# EAGLE board MO-v2-6 (EAGLE 8.3.2)
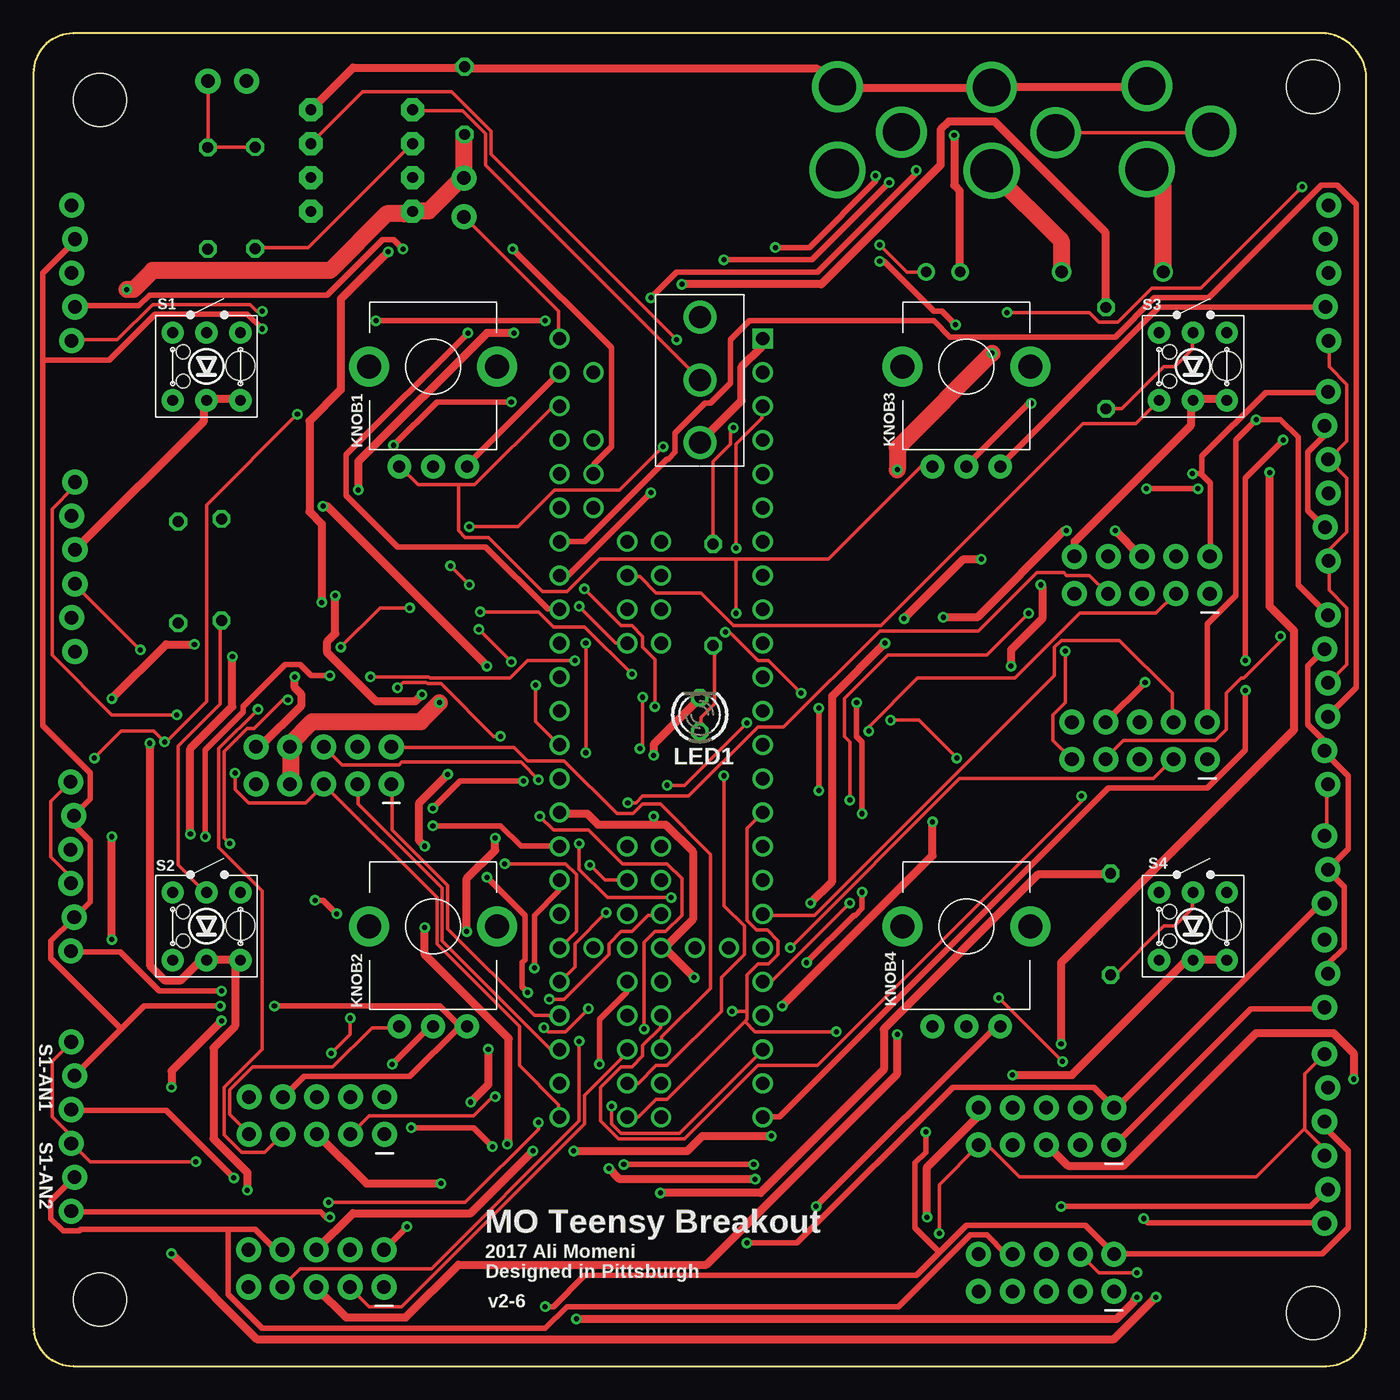
[diagram p1: board, top side]
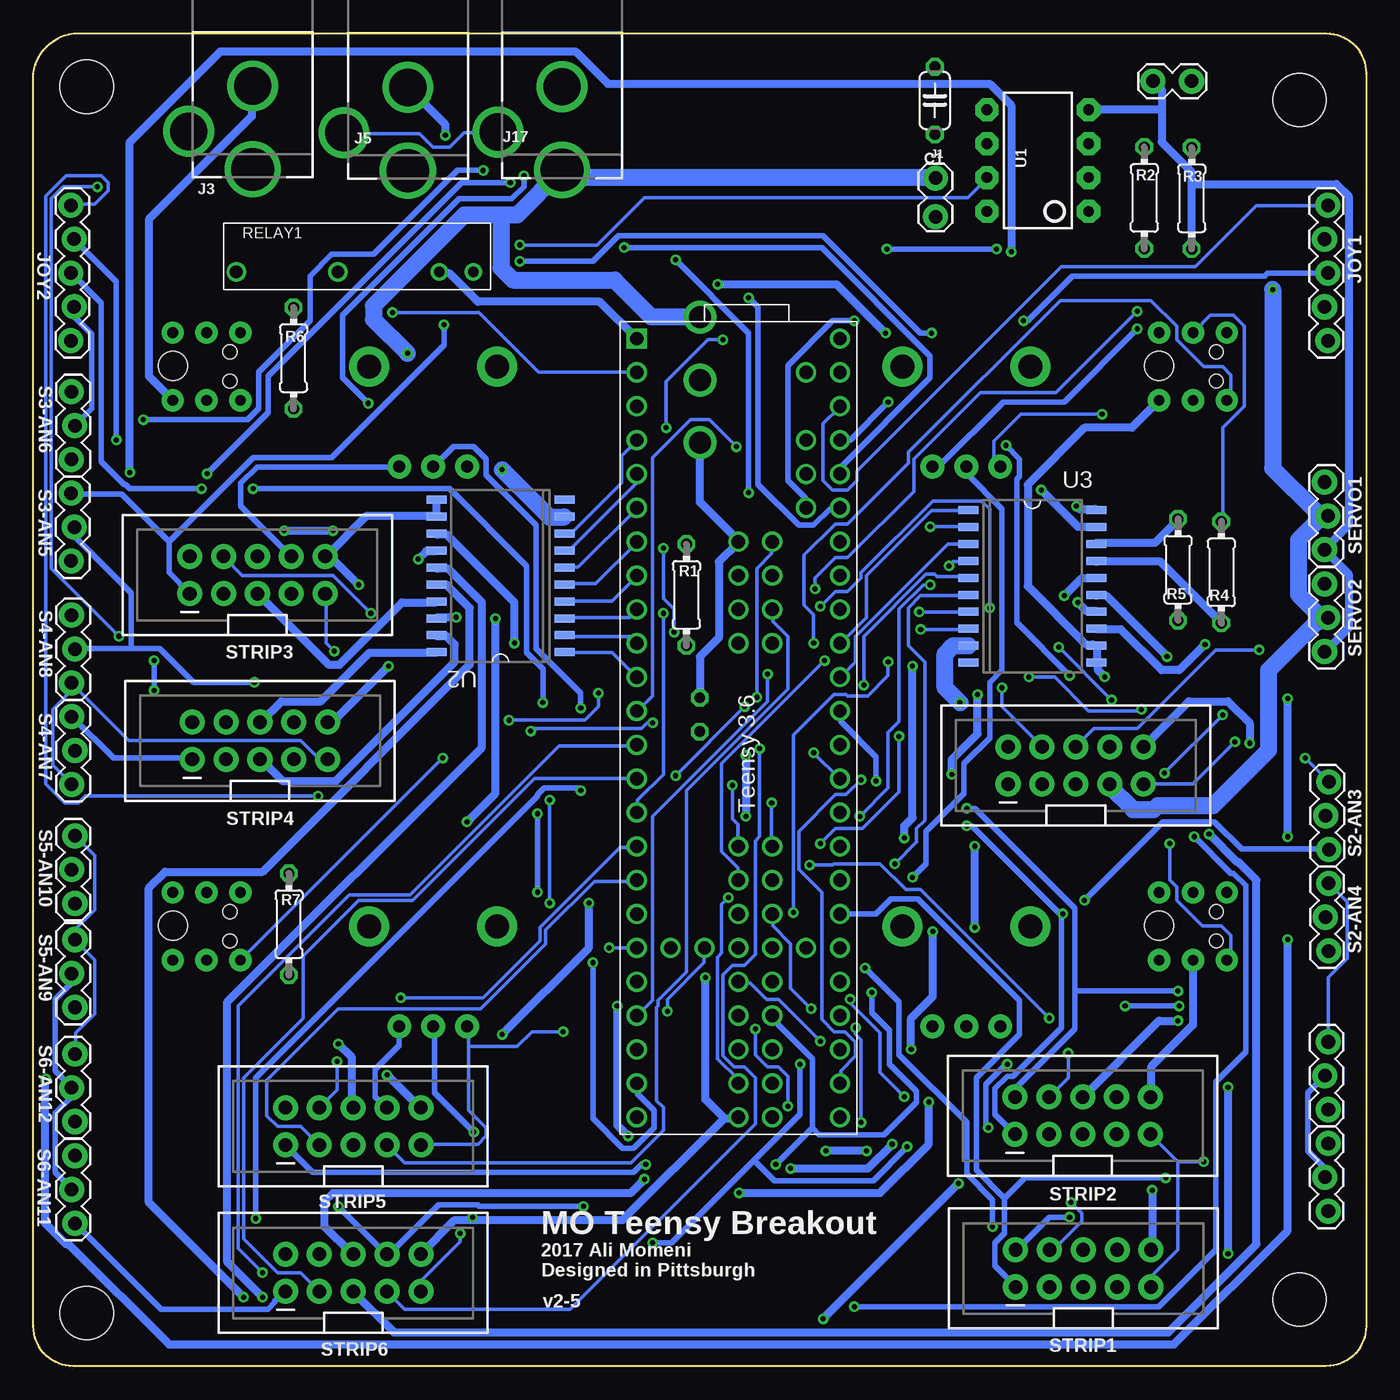
[diagram p2: board, bottom side, seen from below]

Size 100 x 100 mm. Coordinates in mm from the lower left corner, seen from the top.
Outline: 3,100 arc90 0,97 0,3 arc90 3,0 97,0 arc90 100,3 100,97 arc74 97,100 3,100
Copper layers (1*16): Top 0.035559375mm / dielectric 1.501140625mm / Bottom 0.035559375mm
Design rules "typical_4pcb *": minimum track width 10mil, minimum drill 15mil, track to track 6mil, track to pad 10mil, pad to pad 10mil, via to via 10mil, smd to smd 10mil, copper to edge 15mil, drill to drill 8mil, minimum pad ring 10mil, minimum via ring 8mil, stop-mask expansion 4mil, vias tented up to drill 0mil, thermal gap 10mil
Net classes: 0 default: width 0.254 mm, clearance 0.152 mm; 2 Power: width 0.61 mm, clearance 0.305 mm; 3 Analog Sig: width 0.406 mm, clearance 0.305 mm; 4 Power Source: width 1.27 mm, clearance 0.305 mm
Holes 4 mm at 5,5 96,4 96,96 5,95

## Footprints (pad centres in the part's own frame; a part is rotated, then mirrored left to right if it is on the bottom)
C050-024X044 = drill 0.813 octagon: 1 -2.54,0; 2 2.54,0
1X02_LOCK = drill 1.016 pad 1.88: 1 -0.178,0; 2 2.718,0
DCJACK_2MM_PTH = drill 2.8: GND 0,7.35; GNDBREAK 4.8,10.75 | drill 3.2: PWR 0,13.6
2X5-SHROUDED_LOCK = drill 1.016 pad 1.88: 1 -1.397,5.08; 2 1.397,5.08; 3 -1.397,2.54; 4 1.397,2.54; 5 -1.397,0; 6 1.397,0; 7 -1.397,-2.54; 8 1.397,-2.54; 9 -1.397,-5.08; 10 1.397,-5.08
1X05_LOCK = drill 1.016 pad 1.88: 1 0,0.127; 2 2.54,-0.127; 3 5.08,0.127; 4 7.62,-0.127; 5 10.16,0.127
POT_ALPHA_RD901F-40-(L)R1 = drill 0.9 pad 1.778: 1 -2.54,-7.5; 2 0,-7.5; 3 2.54,-7.5 | drill 1.8 pad 3: M1 -4.8,0; M2 4.8,0
LED3MM = drill 0.813 octagon: A -1.27,0; K 1.27,0
0204/7 = drill 0.813 octagon: 1 -3.81,0; 2 3.81,0
G6DN-1A = drill 0.8: 1 0,0; 2 2.54,0 | drill 0.95: 5 10.16,0; 8 17.78,0
SWITCH_TR2-MOMENTARY-LED = drill 0.8 pad 1.676: 1 2.54,-2.54; 2 2.54,2.54; 3 -2.54,-2.54; 4 -2.54,2.54; A 0,2.54; C 0,-2.54 | hole 2.2: 2.53,0.05 | hole 1.05: -1.76,1.1; -1.76,-1.09
1X03_LOCK = drill 1.016 pad 1.88: 1 0,0.127; 2 2.54,-0.127; 3 5.08,0.127
1X03_LOCK@1 = drill 1.016 pad 1.88: 1 0,0.127; 2 2.54,-0.127; 3 5.08,0.127
SWITCH_SPDT_500SSP1S2M2QEA = drill 1.65: 1 -4.7,0; 2 0,0; 3 4.7,0
TEENSY3-6_NO-USB-HOST = drill 1: 0 3.81,1.27; 1 6.35,1.27; 2 8.89,1.27; 3 11.43,1.27; 3V3(1) 36.83,1.27; 3V3(2) 46.99,6.35; 3V3(3) 6.35,16.51; 3V3(4) 59.69,11.43; 4 13.97,1.27; 5 16.51,1.27; 6 19.05,1.27; 7 21.59,1.27; 8 24.13,1.27; 9 26.67,1.27; 10 29.21,1.27; 11 31.75,1.27; 12 34.29,1.27; 13 34.29,16.51; 14 31.75,16.51; 15 29.21,16.51; 16 26.67,16.51; 17 24.13,16.51; 18 21.59,16.51; 19 19.05,16.51; 20 16.51,16.51; 21 13.97,16.51; 22 11.43,16.51; 23 8.89,16.51; 24 39.37,1.27; 25 41.91,1.27; 26 44.45,1.27; 27 46.99,1.27; 28 49.53,1.27; 29 52.07,1.27; 30 54.61,1.27; 31 57.15,1.27; 32 59.69,1.27; 33 59.69,16.51; 34 57.15,16.51; 35 54.61,16.51; 36 52.07,16.51; 37 49.53,16.51; 38 46.99,16.51; 39 44.45,16.51; 40 39.37,8.89; 41 41.91,8.89; 42 44.45,8.89; 43 49.53,8.89; 44 52.07,8.89; 45 54.61,8.89; 46 57.15,8.89; 47 57.15,11.43; 48 54.61,11.43; 49 52.07,11.43; 50 49.53,11.43; 51 44.45,11.43; 52 41.91,11.43; 53 39.37,11.43; 54 24.13,11.43; 55 21.59,11.43; 56 19.05,11.43; 57 16.51,11.43; A10 11.43,13.97; A11 13.97,13.97; AGND 3.81,16.51; AREF 8.89,13.97; DAC0 41.91,16.51; DAC1 39.37,16.51; DC 21.59,8.89; DD 24.13,8.89; DE 19.05,8.89; G1 46.99,8.89; G2 36.83,16.51; G3 59.69,8.89; G6 16.51,8.89; P 46.99,11.43; R 46.99,13.97; VBAT 46.99,3.81; VIN 1.27,16.51; VUSB 3.81,13.97 | drill 1 square: G0 1.27,1.27
DIP08 = drill 0.813 pad 1.727 octagon: 1 -3.81,-3.81; 2 -1.27,-3.81; 3 1.27,-3.81; 4 3.81,-3.81; 5 3.81,3.81; 6 1.27,3.81; 7 -1.27,3.81; 8 -3.81,3.81
SOIC20 = smd 0.6 x 1.5: 1 -5.715,-4.8; 2 -4.445,-4.8; 3 -3.175,-4.8; 4 -1.905,-4.8; 5 -0.635,-4.8; 6 0.635,-4.8; 7 1.905,-4.8; 8 3.175,-4.8; 9 4.445,-4.8; 10 5.715,-4.8; 11 5.715,4.8; 12 4.445,4.8; 13 3.175,4.8; 14 1.905,4.8; 15 0.635,4.8; 16 -0.635,4.8; 17 -1.905,4.8; 18 -3.175,4.8; 19 -4.445,4.8; 20 -5.715,4.8

## Placement (x,y rotation side)
C1  10uF  [C050-024X044]  32.36,94.95 90 bottom
J1  Teensy-5V  [1X02_LOCK]  32.31,86.42 90 bottom
J3  +5V OUT (to Pi)  [DCJACK_2MM_PTH]  83.54,103.4 180 bottom
J4  ACTUATORS  [2X5-SHROUDED_LOCK]  21.78,45.07 90 bottom
J5  +5V IN (Pi)  [DCJACK_2MM_PTH]  71.9,103.3 180 bottom
J12  RPi-Shutdown  [1X02_LOCK]  13.28,96.42 180 bottom
J17  +5V IN (Main)  [DCJACK_2MM_PTH]  60.33,103.35 180 bottom
JOY1  JOY1  [1X05_LOCK]  3,87.1 270 bottom
JOY2  JOY2  [1X05_LOCK]  97.06,76.94 90 bottom
KNOB1  [POT_ALPHA_RD901F-40-(L)R1]  30,75 0 top
KNOB2  [POT_ALPHA_RD901F-40-(L)R1]  30,33 0 top
KNOB3  [POT_ALPHA_RD901F-40-(L)R1]  70,75 0 top
KNOB4  [POT_ALPHA_RD901F-40-(L)R1]  70,33 0 top
LED1  [LED3MM]  50,48.88 90 top
R1  330  [0204/7]  51,57.87 270 bottom
R2  2.2K  [0204/7]  16.65,87.65 90 bottom
R3  3.3K  [0204/7]  13.09,87.63 270 bottom
R4  330  [0204/7]  10.87,59.56 90 bottom
R5  330  [0204/7]  14.12,59.76 270 bottom
R6  330  [0204/7]  80.48,75.63 270 bottom
R7  330  [0204/7]  80.82,33.16 270 bottom
RELAY1  RELAY-OMRON-G6DN  [G6DN-1A]  67,82.09 180 bottom
S1  SW-LEDPTH  [SWITCH_TR2-MOMENTARY-LED]  13,75 0 top
S1-AN1  AN5  [1X03_LOCK]  2.97,24.33 270 bottom
S1-AN2  AN6  [1X03_LOCK]  2.97,16.71 270 bottom
S2  SW-LEDPTH  [SWITCH_TR2-MOMENTARY-LED]  13,33 0 top
S2-AN3  AN7  [1X03_LOCK]  2.92,43.84 270 bottom
S2-AN4  AN8  [1X03_LOCK]  2.94,36.23 270 bottom
S3  SW-LEDPTH  [SWITCH_TR2-MOMENTARY-LED]  87,75 0 top
S3-AN5  AN5  [1X03_LOCK]  97.04,60.41 90 bottom
S3-AN6  AN6  [1X03_LOCK]  97.02,68.03 90 bottom
S4  SW-LEDPTH  [SWITCH_TR2-MOMENTARY-LED]  87,33 0 top
S4-AN7  AN7  [1X03_LOCK]  97,43.65 90 bottom
S4-AN8  AN8  [1X03_LOCK]  97.01,51.26 90 bottom
S5-AN9  AN5  [1X03_LOCK]  97,32 270 bottom
S5-AN10  AN6  [1X03_LOCK]  97,39.8 270 bottom
S6-AN11  AN7  [1X03_LOCK]  97,15.79 270 bottom
S6-AN12  AN8  [1X03_LOCK]  97,23.43 270 bottom
SERVO1  SERVO1  [1X03_LOCK@1]  3,61.25 90 bottom
SERVO2  SERVO2  [1X03_LOCK@1]  3,53.62 90 bottom
STRIP1  [2X5-SHROUDED_LOCK]  21.22,7.33 90 bottom
STRIP2  [2X5-SHROUDED_LOCK]  21.26,18.8 90 bottom
STRIP3  [2X5-SHROUDED_LOCK]  83.19,59.36 90 bottom
STRIP4  [2X5-SHROUDED_LOCK]  83,46.92 90 bottom
STRIP5  [2X5-SHROUDED_LOCK]  76,18 90 bottom
STRIP6  [2X5-SHROUDED_LOCK]  76,7 90 bottom
SW2  500SSP1S2M2QEA  [SWITCH_SPDT_500SSP1S2M2QEA]  50,74 270 top
TEENSY  TEENSY3_6-ALI_NO-USB-HOST  [TEENSY3-6_NO-USB-HOST]  55.99,78.37 270 bottom
U1  ATTINY85DIP08  [DIP08]  24.63,90.45 90 bottom
U2  A2982  [SOIC20]  64.95,59.29 90 bottom
U3  A2982  [SOIC20]  25.03,58.51 270 bottom

## Tracks (layer width: path | path; a pad name or v marks a point on that pad's centre or on a via)
+3V3  (via drill 0.38)
  Top 0.254: JOY2.1 97.23,76.91 97.23,74.98 98.55,73.66 98.55,69.39 97.23,68.07 S3-AN6.1 97.23,67.97 98.55,66.65 98.55,62.59 97.23,61.27 97.23,60.45 S3-AN5.1 97.23,60.35 97.23,58.22 98.55,56.9 98.55,52.63 97.23,51.31 S4-AN8.1 | v77.42,53.65 77.42,49.78 76.5,48.87 76.5,46.94 77.83,45.62 STRIP4.9 | 53.39,25.86 53.54,26.01 53.54,26.62 | 53.39,25.86 47.55,20.02 46.74,20.02 45.41,18.69 44.6,18.69 TEENSY.3V3(4) | 53.54,26.62 53.54,29.36 54.36,30.18 55.17,30.18 55.88,30.89 55.88,31.9 55.07,32.72 54.25,32.72 53.54,33.43 53.54,40.34 54.66,41.45 TEENSY.3V3(1) | 53.54,26.62 v52.43,26.62 | v67.97,9.96 67.97,13.61 70.92,16.56 STRIP5.9 71.02,16.56 71.63,16.56 73.97,14.22 91.75,14.22 95.3,17.78 95.4,17.78 | 95.4,17.78 96.83,16.36 96.83,15.85 S6-AN11.1 | 95.4,17.78 95.4,21.95 96.83,23.37 S6-AN12.1 | S4-AN7.1 97.03,43.59 97.03,39.93 96.93,39.83 S5-AN10.1 | 53.39,25.86 54.15,25.09 v60.25,25.09 | KNOB2.1 27.43,25.4 25.4,25.4 22.45,22.45 16.46,22.45 14.73,20.73 14.73,18.9 16.15,17.48 STRIP2.9 | S1-AN1.1 2.85,24.28 1.42,22.86 1.42,18.69 2.85,17.27 2.85,16.76 S1-AN2.1 2.95,16.66 4.27,15.34 v12.19,15.34 | S2-AN4.1 2.74,36.27 2.74,36.78 1.32,38.2 1.32,42.37 2.74,43.79 S2-AN3.1 | v4.57,45.62 6.6,47.65 9.04,47.65 v9.86,46.84 9.96,46.84 13.01,49.89 13.01,64.62 v19.81,71.42 | 31.9,66.14 28.85,66.14 27.53,67.46 KNOB1.1 | 31.9,66.14 33.12,66.14 38.91,71.93 39.42,71.93 TEENSY.3V3(3) | 52.73,60.55 42.47,60.55 40.03,58.12 38.2,58.12 34.14,62.18 32.41,62.18 31.9,62.69 31.9,66.14 | 52.73,60.55 59.64,60.55 66.55,67.46 67.36,67.46 KNOB3.1 | 52.73,60.55 v52.73,56.49
  Bottom 0.254: STRIP4.9 77.93,45.62 78.64,45.62 79.96,46.94 92.86,46.94 97.13,51.21 S4-AN8.1 96.93,50.9 98.55,49.28 98.55,45.11 97.13,43.69 S4-AN7.1 | v77.42,53.65 78.03,54.25 78.03,57.91 STRIP3.9 | v52.43,26.62 52.43,27.53 49.68,30.28 49.68,31.29 TEENSY.3V3(2) | 67.36,23.98 67.36,19.2 66.04,17.88 66.04,17.27 66.65,16.66 70.92,16.66 STRIP5.9 | 67.36,23.98 67.36,25.4 KNOB4.1 | v67.97,9.96 67.97,9.35 70.92,6.4 70.92,5.69 STRIP6.9 | S5-AN10.1 96.83,39.73 95.4,38.3 95.4,34.24 96.83,32.82 96.83,32 S5-AN9.1 96.83,31.9 95.4,30.48 95.4,26.42 96.83,24.99 96.83,23.47 S6-AN12.1 | v60.25,25.09 62.59,25.09 63.7,23.98 67.36,23.98 | 14.12,15.34 14.12,8.74 16.05,6.81 16.05,5.99 STRIP1.9 | 14.12,15.34 16.15,17.37 STRIP2.9 | v9.86,46.84 13.01,43.69 16.66,43.69 J4.9 | v4.57,45.62 2.85,43.89 S2-AN3.1 | S1-AN1.1 2.85,24.38 2.85,29.16 1.42,30.58 1.42,34.85 2.74,36.17 S2-AN4.1 | v12.19,15.34 14.12,15.34 | JOY1.1 2.95,87.07 8.23,87.07 12.8,82.5 22.86,82.5 38.2,67.16 38.2,66.45 38.91,65.73 40.03,65.73 40.74,66.45 40.74,70.71 39.52,71.93 TEENSY.3V3(3) | v19.81,71.42 25.91,71.42 27.94,69.39 27.94,67.97 27.53,67.56 KNOB1.1 | v52.73,56.49 52.73,44.4 54.66,42.47 54.66,41.55 TEENSY.3V3(1)
+5V  (via drill 0.38)
  Top 1.27: v30.48,49.78 29.06,48.36 20.93,48.36 19.3,46.74 19.3,46.53 J4.8 19.3,45.92 19.3,43.69 J4.7 | C1.1 32.31,92.35 32.31,89.2 J1.2 31.8,88.8 29.67,86.67 28.45,86.67 U1.8 27.84,86.46 26.52,86.46 22.25,82.19 8.94,82.19 7.52,80.77 v7.01,80.77 | v64.82,67.26 64.82,68.89 v71.93,76
  Bottom 1.27: v30.48,49.78 31.6,50.9 31.6,53.44 30.99,54.05 29.87,54.05 U3.9 | J4.7 19.3,43.59 17.48,41.76 15.95,41.76 15.65,42.06 11.48,42.06 7.32,46.23 7.32,52.22 3.76,55.78 SERVO2.2 2.95,56.19 3.35,56.19 5.08,57.91 5.08,61.98 3.35,63.7 2.95,63.7 SERVO1.2 3.76,64.11 7.01,67.36 v7.01,80.77 | v64.82,67.26 61.27,63.7 60.25,63.7 U2.9 | v71.93,76 74.47,78.54 74.47,79.55 67.67,86.36 64.92,86.36 | 64.92,86.36 63.7,86.36 60.35,89.71 J17.PWR 59.74,89.51 59.44,89.2 32.41,89.2 J1.2 | 64.92,86.36 64.92,82.4 64.01,81.48 56.39,81.48 53.65,78.74 50.09,78.74 SW2.1
+5V-BATTERY-PI
  Top 1.27: RELAY1.5 77.11,82.09 77.11,84.43 71.93,89.61 J5.PWR
AGND  (via drill 0.38)
  Top 0.406: S3-AN6.2 96.83,70.51 96.83,69.8 95.61,68.58 95.61,64.21 96.83,62.99 S3-AN5.2 | KNOB3.3 72.54,67.56 84.43,79.45 96.93,79.45 JOY2.2 | v83.41,51.31 80.47,48.36 STRIP4.8 | S4-AN8.2 96.83,53.75 95.61,52.53 95.61,48.16 96.83,46.94 96.83,46.23 S4-AN7.2 96.93,46.02 98.65,44.3 98.65,38.81 97.23,37.39 S5-AN10.2 97.13,37.19 98.35,35.97 98.35,31.39 97.13,30.18 S5-AN9.2 | v77.11,11.99 95.81,11.99 97.03,13.21 S6-AN11.2 | v58.73,11.99 72.14,25.4 72.44,25.4 KNOB4.3 | STRIP2.8 18.8,20.22 20.32,21.74 28.25,21.74 31.9,25.4 32.51,25.4 KNOB2.3 31.8,25.5 31.8,25.7 30.48,27.03 v18.09,27.03 | 14.63,10.26 3.56,10.26 3.45,10.16 2.23,10.16 1.32,11.07 1.32,12.39 3.05,14.12 S1-AN2.2 | 14.63,10.26 16.66,10.26 18.19,8.74 18.59,8.74 STRIP1.8 | v14.02,27.03 8.33,27.03 6.6,25.3 | 6.6,25.3 3.15,21.84 S1-AN1.2 | TEENSY.AGND 39.42,74.47 32.51,67.56 KNOB1.3 | 0.71,75.49 0.71,48.06 4.27,44.5 4.27,42.57 3.15,41.45 S2-AN3.2 3.05,41.25 3.05,40.64 4.27,39.42 4.27,34.85 3.15,33.73 S2-AN4.2 2.95,33.53 1.32,31.9 1.32,30.58 6.6,25.3 | 0.71,75.49 0.71,81.99 3.05,84.33 3.05,84.53 JOY1.2 | v17.17,77.83 16.05,78.94 9.14,78.94 5.69,75.49 0.71,75.49 | 14.63,10.26 14.63,5.38 17.17,2.85 38.41,2.85 40.03,4.47 64.92,4.47 70.31,9.86 71.53,9.86 72.95,8.43 73.46,8.43 STRIP6.8
  Bottom 0.406: KNOB3.3 72.54,67.46 83.21,67.46 84.43,66.24 84.43,64.52 80.67,60.76 STRIP3.8 | JOY2.2 96.93,79.45 96.93,78.74 95.61,77.42 95.61,71.83 96.83,70.61 S3-AN6.2 | v83.41,51.31 87.99,51.31 90.53,53.85 92.66,53.85 | 92.66,53.85 96.83,53.85 S4-AN8.2 | KNOB4.3 72.54,25.4 72.54,24.08 74.37,22.25 74.37,20.22 73.56,19.41 STRIP5.8 | v77.11,11.99 73.56,8.43 STRIP6.8 73.25,8.43 69.6,12.09 66.65,12.09 66.55,11.99 v58.73,11.99 | S6-AN11.2 97.13,13.31 98.35,14.53 98.35,19 97.13,20.22 97.13,20.83 S6-AN12.2 97.23,21.03 98.35,22.15 98.35,27.53 97.13,28.75 97.13,29.36 S5-AN9.2 | 92.66,53.85 92.66,58.01 96.83,62.18 96.83,62.89 S3-AN5.2 | S1-AN2.2 3.15,14.22 3.15,14.94 4.37,16.15 4.37,20.52 3.15,21.74 S1-AN1.2 | v14.02,27.03 v18.09,27.03 | v17.17,77.83 22.66,72.34 27.23,72.34 32,67.56 32.51,67.56 KNOB1.3
AN1  (via drill 0.38)
  Top 0.406: v15.04,14.12 9.96,19.2 2.95,19.2 S1-AN1.3
  Bottom 0.406: 27.13,12.6 29.26,14.73 29.26,21.64 26.01,24.89 26.01,27.43 33.63,35.05 35.66,35.05 36.78,33.93 39.42,33.93 TEENSY.39 | 27.13,12.6 27.13,9.96 27.84,9.25 27.84,7.52 26.31,5.99 STRIP1.1 | v15.04,14.12 25.6,14.12 27.13,12.6
AN2  (via drill 0.38)
  Top 0.406: v37.59,29.87 37.59,33.83 39.42,35.66 39.42,36.37 TEENSY.DAC0 | v28.04,10.46 26.31,8.74 STRIP1.2 | v22.25,11.18 21.95,11.18 21.54,11.58 2.95,11.58 S1-AN2.3
  Bottom 0.406: v37.59,29.87 35.05,27.33 35.05,23.37 29.97,18.29 29.97,14.43 28.04,12.5 v28.04,10.46 | v22.25,11.18 23.77,11.18 26.21,8.74 STRIP1.2
AN3  (via drill 0.38)
  Top 0.406: v29.97,40.54 35.05,40.54 36.58,39.01 39.42,39.01 TEENSY.DAC1 | v21.13,34.95 21.74,34.95 v22.76,33.93
  Bottom 0.406: v29.97,40.54 29.57,40.54 22.86,33.83 | 22.86,33.83 22.86,25.4 26.52,21.74 26.92,21.74 27.84,20.83 27.84,18.9 26.42,17.48 STRIP2.1 | v21.13,34.95 15.24,40.84 11.38,40.84 9.35,38.81 2.85,38.81 S2-AN3.3 | v22.76,33.93 22.86,33.83
AN4  (via drill 0.38)
  Top 0.406: v36.78,43.89 32,43.89 v29.97,41.86 | v14.12,28.14 9.45,28.14 6.5,31.09 2.85,31.09 S2-AN4.3
  Bottom 0.406: v36.78,43.89 36.78,45.72 39.42,48.36 39.42,49.07 TEENSY.15 | v29.97,41.86 29.36,41.86 21.84,34.34 21.84,28.14 | 21.84,28.14 21.84,25.3 26.31,20.83 26.31,20.22 STRIP2.2 | 21.84,28.14 v14.12,28.14
AN5  (via drill 0.38)
  Top 0.406: v32.61,77.52 23.47,68.38 23.47,65.33 27.33,61.47 33.93,61.47 38.61,56.79 39.42,56.79 TEENSY.18 | v63.5,82.91 63.8,82.91 67.56,79.15 68.17,79.15 v69.19,78.13
  Bottom 0.406: v32.61,77.52 33.43,77.52 40.74,84.84 56.08,84.84 58.01,82.91 v63.5,82.91 | v69.19,78.13 69.19,76.61 77.62,68.17 83.52,68.17 89.81,61.87 | 89.81,61.87 89.81,59.54 88.29,58.01 STRIP3.1 | 89.81,61.87 93.37,65.43 97.13,65.43 S3-AN5.3
AN6  (via drill 0.38)
  Top 0.406: v46.33,65.53 40.13,59.33 39.52,59.33 TEENSY.19 | v51.82,83.01 58.42,83.01 v64.21,88.8 | 87.58,66.95 v86.97,66.95 | 87.58,66.95 88.29,66.24 88.29,60.76 STRIP3.2 | S3-AN6.3 97.13,73.05 92.46,73.05 87.68,68.28 87.68,67.06 87.58,66.95
  Bottom 0.406: v46.33,65.53 46.33,77.52 v51.82,83.01 | v64.21,88.8 67.87,88.8 82.4,74.27 82.4,71.53 v86.97,66.95
AN7
  Top 0.406: TEENSY.20 39.52,61.87 41.35,61.87 47.55,68.07 47.65,68.07 48.16,68.58 48.16,70 50.39,72.24 50.8,72.24 52.32,73.76 52.32,77.01 53.75,78.44 67.56,78.44 68.78,77.22 81.18,77.22 84.12,80.16 88.19,80.16 96.62,88.59 97.84,88.59 99.26,87.17 99.26,50.9 97.13,48.77 S4-AN7.3
  Bottom 0.406: STRIP4.1 88.09,45.62 93.98,45.62 97.03,48.67 S4-AN7.3
AN8  (via drill 0.38)
  Top 0.406: v46.33,80.16 48.26,82.09 58.83,82.09 66.24,89.51 v66.24,89.71 | S4-AN8.3 97.13,56.39 94.89,58.62 94.89,69.7 93.57,71.02 v91.75,71.02 90.22,69.49 90.22,57.81 88.09,55.68 88.09,48.36 STRIP4.2
  Bottom 0.406: v46.33,80.16 45.62,79.45 45.62,66.14 42.57,63.09 41.45,63.09 40.23,64.31 39.52,64.31 TEENSY.21 | v66.24,89.71 68.17,89.71 74.47,83.41 77.62,83.41 79.25,81.79 79.25,78.44 83.11,74.57 83.11,71.83 83.92,71.02 v91.75,71.02
AN9  (via drill 0.38)
  Top 0.406: v54.05,15.14 v44.3,15.14 | v34.04,36.68 36.88,33.83 36.88,30.48 36.68,30.28 36.68,28.45 v37.08,28.04 | S5-AN9.3 96.83,26.82 91.34,26.82 81.18,16.66 STRIP5.1
  Bottom 0.406: 41.55,17.88 41.55,23.06 44.5,26.01 44.5,26.21 TEENSY.49 | v44.3,15.14 41.55,17.88 | v54.05,15.14 54.36,15.14 54.97,14.53 79.05,14.53 81.08,16.56 STRIP5.1 | v34.04,36.68 33.02,37.69 33.02,40.13 30.18,42.98 30.18,45.21 28.25,47.14 28.25,51.31 27.33,52.22 27.33,64.31 29.97,66.95 29.97,67.46 KNOB1.2 | v37.08,28.04 37.08,26.52 35.76,25.2 35.76,22.66 33.73,20.62 33.73,19.81 36.17,17.37 41.05,17.37 41.55,17.88
AN10  (via drill 0.38)
  Top 0.406: v42.47,22.66 42.47,26.01 44.5,28.04 44.5,28.75 TEENSY.50 | v53.54,9.25 57.3,9.25 68.99,20.93 79.55,20.93 STRIP5.2 81.28,19.41 96.52,34.65 96.83,34.65 S5-AN10.3 | v26.92,22.66 29.67,25.4 29.97,25.4 KNOB2.2 | v28.35,17.88 33.02,17.88 v34.44,16.46
  Bottom 0.406: v42.47,22.66 42.47,18.9 45.92,15.44 | 45.92,15.44 52.12,9.25 v53.54,9.25 | v26.92,22.66 27.13,22.45 27.23,22.45 28.55,21.13 28.55,18.09 v28.35,17.88 | v34.44,16.46 36.98,13.92 44.4,13.92 45.92,15.44
AN11  (via drill 0.38)
  Top 0.406: v55.68,83.92 58.22,83.92 63.2,88.9 v63.2,89.31 | v74.88,72.24 74.68,72.24 70,67.56 KNOB3.2 | v83.31,11.07 83.62,10.77 96.83,10.77 S6-AN11.3 | v58.93,49.38 v58.93,43.18
  Bottom 0.406: STRIP6.1 81.18,5.59 81.89,4.88 81.89,4.78 82.4,4.27 90.42,4.27 96.83,10.67 S6-AN11.3 | v55.68,83.92 40.84,83.92 32.72,75.79 32.72,74.17 39.42,67.46 39.42,66.95 TEENSY.22 | v63.2,89.31 63.2,88.49 64.11,87.58 68.07,87.58 76.81,78.84 76.81,74.17 v74.88,72.24 | v83.31,11.07 83.31,21.64 62.18,42.77 62.18,42.88 61.67,43.38 59.13,43.38 v58.93,43.18 | v58.93,49.38 58.93,50.49 62.28,53.85 62.28,63.09 66.04,66.85 66.04,68.07 66.95,68.99 68.48,68.99 69.9,67.56 KNOB3.2
AN12  (via drill 0.38)
  Top 0.406: v35.87,72.34 30.28,72.34 v27.03,69.09 | v22.25,51.82 20.83,51.82 20.02,52.63 18.9,52.63 15.75,49.48 15.75,49.07 12.9,46.23 v12.9,39.73 | v38.41,4.47 39.01,4.47 41.35,6.81 66.24,6.81 67.97,8.53 | 67.97,8.53 70,10.57 78.94,10.57 81.08,8.43 STRIP6.2 81.28,8.43 96.72,8.43 98.65,10.36 98.65,16.15 96.93,17.88 96.93,18.29 S6-AN12.3 | v66.95,17.58 66.95,16.05 66.14,15.24 66.14,10.36 67.97,8.53
  Bottom 0.406: v35.87,72.34 38.71,69.49 39.42,69.49 TEENSY.23 | v27.03,69.09 26.01,68.07 26.01,66.75 26.21,66.55 26.21,55.78 v22.25,51.82 | v12.9,39.73 10.16,36.98 9.96,36.98 9.04,36.07 9.04,23.57 11.28,21.34 11.28,8.74 15.54,4.47 v38.41,4.47 | v66.95,17.58 69.9,20.52 69.9,25.4 KNOB4.2
BTN1
  Top 0.254: TEENSY.48 44.5,23.67 44.5,23.47 41.35,20.32 41.35,18.19 27.64,4.47 25.2,4.47 23.77,5.89 STRIP1.3
BTN2  (via drill 0.38)
  Top 0.254: v41.66,26.82 39.93,25.09 38.61,25.09 v38.3,25.4 | v37.9,18.29 37.9,17.78 32.41,12.29 v22.15,12.29
  Bottom 0.254: v41.66,26.82 43.18,28.35 43.18,31.7 44.5,33.02 44.5,33.83 TEENSY.51 | v38.3,25.4 38.3,24.89 37.9,24.49 v37.9,18.29 | v22.15,12.29 21.34,11.48 21.34,10.87 23.47,8.74 23.67,8.74 STRIP1.4
BTN3  (via drill 0.38)
  Top 0.254: v38.71,27.53 39.83,27.53 43.18,30.89 43.18,31.7 44.09,32.61 44.91,32.61 46.13,33.83 47.04,33.83 TEENSY.42 | v34.65,20.22 34.44,20.22 33.02,18.8 25.2,18.8 23.88,17.48 STRIP2.3
  Bottom 0.254: v38.71,27.53 38.71,27.23 36.47,24.99 36.47,22.05 v34.65,20.22
BTN4  (via drill 0.38)
  Top 0.254: v41.76,37.59 42.88,36.47 44.5,36.47 TEENSY.52 | v23.77,26.11 23.77,24.89 v22.35,23.47
  Bottom 0.254: v41.76,37.59 40.03,37.59 39.93,37.69 36.47,37.69 34.54,35.76 33.43,35.76 v23.77,26.11 | v22.35,23.47 22.35,21.64 23.77,20.22 STRIP2.4
BTN5  (via drill 0.38)
  Top 0.254: v47.55,43.59 48.87,43.59 v53.54,48.26 | v62.69,47.65 62.69,47.95 66.34,51.61 73.66,51.61 78.54,56.49 84.23,56.49 85.65,57.91 STRIP3.3
  Bottom 0.254: v47.55,43.59 47.55,41.05 47.14,40.64 47.14,39.01 TEENSY.40 | v53.54,48.26 53.95,48.26 54.36,47.85 62.48,47.85 v62.69,47.65
BTN6  (via drill 0.38)
  Top 0.254: v61.27,34.75 55.37,28.85 54.76,28.85 TEENSY.28 | v61.27,42.47 61.27,46.84 60.86,47.24 60.86,50.09 64.11,53.34 71.53,53.34 v74.68,56.49
  Bottom 0.254: v61.27,42.47 v61.27,34.75 | v74.68,56.49 77.52,59.33 84.33,59.33 85.65,60.66 STRIP3.4
BTN7  (via drill 0.38)
  Top 0.254: v56.79,31.39 69.49,44.09 84.02,44.09 85.45,45.52 STRIP4.3
  Bottom 0.254: v56.79,31.39 54.76,31.39 TEENSY.27
BTN8
  Top 0.254: TEENSY.26 54.76,33.83 58.62,33.83 76.61,51.82 76.61,53.95 77.11,54.46 81.48,54.46 85.45,50.49 85.45,48.36 STRIP4.4
BTN9
  Bottom 0.254: TEENSY.25 54.76,36.37 57.91,36.37 61.57,32.72 61.57,31.7 66.45,26.82 77.11,26.82 82.5,21.44 82.5,18.8 81.69,17.98 79.96,17.98 78.64,16.66 STRIP5.3
BTN10  (via drill 0.38)
  Top 0.254: v77.22,22.86 v72.44,27.64
  Bottom 0.254: v72.44,27.64 66.24,27.64 61.98,31.9 61.98,32.92 55.98,38.91 54.76,38.91 TEENSY.24 | v77.22,22.86 77.22,20.73 STRIP5.4
BTN11
  Bottom 0.254: TEENSY.12 54.76,44.09 62.38,44.09 71.53,34.95 75.59,34.95 79.76,30.79 79.76,26.11 84.23,21.64 84.23,9.55 81.69,7.01 79.96,7.01 78.64,5.69 STRIP6.3
BTN12  (via drill 0.38)
  Top 0.254: v82.8,7.01 79.96,7.01 78.64,8.33 STRIP6.4
  Bottom 0.254: v82.8,7.01 84.63,8.84 84.63,27.03 76.3,35.36 71.73,35.36 60.55,46.53 54.76,46.53 TEENSY.11
BTN13  (via drill 0.38)
  Top 0.254: v41.45,54.25 v41.45,46.02
  Bottom 0.254: v41.45,46.02 39.52,44.09 TEENSY.13 | v41.45,54.25 41.45,56.39 42.16,57.1 42.16,60.86 39.83,63.2 38.91,63.2 34.34,67.77 34.34,68.58 22.96,79.96 16.15,79.96 14.22,78.03 14.22,77.01 12.19,74.98 10.77,74.98 10.16,74.37 10.16,72.75 10.36,72.54 S1.3
BTN14  (via drill 0.38)
  Top 0.254: v40.95,57 43.69,54.25 44.5,54.25 TEENSY.54 | v28.25,56.9 26.01,56.9 v23.06,53.95 | v19.1,49.99 18.69,49.99 16.56,47.85 16.05,47.85 14.33,46.13 14.33,39.62 v14.73,39.22
  Bottom 0.254: v40.95,57 39.83,58.12 38.91,58.12 37.9,59.13 37.9,59.54 32.51,64.92 28.85,64.92 28.25,64.31 v28.25,56.9 | v19.1,49.99 v23.06,53.95 | v14.73,39.22 14.73,36.47 14.22,35.97 14.22,34.95 12.29,33.02 10.87,33.02 10.16,32.31 10.16,30.68 10.36,30.48 S2.3
BTN15
  Top 0.254: TEENSY.56 44.6,59.23 45.52,59.23 46.74,58.01 50.09,58.01 52.53,55.58 63.6,55.58 78.74,70.71 82.7,70.71 84.43,72.44 S3.3
BTN16  (via drill 0.38)
  Top 0.254: v52.73,61.37 52.73,69.19 54.66,71.12 54.66,71.93 TEENSY.1 | v51.92,55.07 52.22,55.07 54.36,52.93 55.17,52.93 v57.61,50.49 | v64.31,48.46 66.45,48.46 v69.29,45.62
  Bottom 0.254: v52.73,61.37 52.73,57.61 51.92,56.79 v51.92,55.07 | v57.61,50.49 57.61,49.48 58.62,48.46 v64.31,48.46 | v69.29,45.62 84.43,30.48 S4.3
GND  (via drill 0.38)
  Top 0.61: v16.05,13.21 16.05,14.53 13.51,17.07 13.51,23.88 15.14,25.5 15.14,30.28 S2.1 15.44,30.48 13.01,30.48 S2.C 12.7,30.38 12.5,30.38 11.07,28.96 9.86,28.96 8.74,30.07 v8.74,46.74 | v19.61,51.71 19.61,50.9 20.12,50.39 20.12,49.58 17.07,46.53 16.76,46.53 J4.10 | S1.1 15.44,72.54 13.01,72.54 S1.C 12.8,72.24 12.8,70.92 3.15,61.27 SERVO1.1 | 46.53,40.64 42.37,40.64 41.55,41.45 39.52,41.45 TEENSY.G2 | 46.53,40.64 47.45,40.64 49.48,38.61 49.48,33.53 47.35,31.39 47.14,31.39 TEENSY.G1 47.55,31.19 v49.58,29.16 | S4.1 89.51,30.48 87.07,30.48 S4.C 86.77,30.28 86.36,30.28 77.93,21.84 v73.46,21.84 | v67.06,11.18 67.06,14.94 70.92,18.8 70.92,19.3 STRIP5.10 | TEENSY.G0 54.66,77.01 54.66,76.5 53.14,74.98 53.14,72.44 50.09,69.39 SW2.3 | S3.1 89.51,72.54 87.07,72.54 S3.C 86.87,72.24 86.87,70.61 78.13,61.87 78.13,60.76 STRIP3.10 | v73.36,52.53 73.36,53.75 75.69,56.08 75.69,58.52 v75.59,58.62 | U1.4 20.83,94.28 23.98,97.43 32.31,97.43 C1.2 32.61,97.33 58.83,97.33 60.05,96.11 J17.GND 60.35,95.91 71.83,95.91 J5.GND 72.14,96.01 83.52,96.01 J3.GND | v69.09,92.35 69.09,88.59 69.49,88.19 69.49,82.09 RELAY1.2 | v46.53,41.25 46.53,40.64 | v46.53,45.82 46.53,46.63 49.99,50.09 LED1.K
  Bottom 0.61: v16.05,13.21 16.05,8.74 STRIP1.10 | STRIP2.10 16.15,20.22 16.15,22.45 13.01,25.6 13.01,30.38 S2.C | v19.61,51.71 20.12,52.22 20.12,52.53 U3.11 20.22,52.83 20.22,54.05 U3.12 20.52,54.15 21.03,54.15 25.4,58.52 25.4,66.14 21.13,70.41 17.58,70.41 15.54,72.44 S1.1 | SERVO2.1 3.05,53.65 1.32,55.37 1.32,59.44 3.05,61.16 SERVO1.1 2.95,61.47 1.32,63.09 1.32,87.78 2.23,88.7 13.11,88.7 | v8.74,46.74 8.74,48.26 10.36,49.89 13.31,49.89 16.66,46.53 J4.10 | 48.16,18.59 47.14,18.59 TEENSY.G3 | 48.16,18.59 55.78,10.97 67.06,10.97 | 67.06,10.97 68.38,10.97 70.92,8.43 STRIP6.10 | v67.06,11.18 67.06,10.97 | v73.46,21.84 71.02,19.41 STRIP5.10 | v49.58,29.16 49.58,20.02 48.16,18.59 | RELAY1.2 69.49,81.99 68.78,81.99 66.65,79.86 57.51,79.86 54.76,77.11 TEENSY.G0 | LED1.K 49.99,50.19 49.99,53.24 48.56,54.66 48.56,60.35 47.14,61.77 TEENSY.G6 47.24,62.08 49.99,64.82 49.99,69.29 SW2.3 | U2.11 69.8,64.92 69.8,63.8 U2.12 70.1,63.8 74.98,63.8 78.03,60.76 STRIP3.10 77.72,60.76 v75.59,58.62 | v73.36,52.53 77.52,48.36 77.83,48.36 STRIP4.10 | 13.11,88.7 13.11,89.61 15.34,91.85 15.34,94.28 | 13.11,88.7 13.11,83.82 R3.2 | 15.34,94.28 15.34,95.81 15.95,96.42 J12.2 | 15.34,94.28 20.73,94.28 U1.4 | S3.1 89.61,72.54 91.34,74.27 91.34,86.06 83.62,93.78 83.62,96.01 J3.GND | v69.09,92.35 69.09,93.17 71.83,95.91 J5.GND | v46.53,45.82 v46.53,41.25
GNDBREAK
  Top 0.254: J3.GNDBREAK 88.29,92.56 J5.GNDBREAK
  Bottom 0.254: J17.GNDBREAK 65.23,92.56 67.67,92.56 68.78,91.44 70,91.44 71.02,92.46 76.61,92.46 J5.GNDBREAK
JOYBTN1  (via drill 0.38)
  Top 0.254: v51.82,44.3 51.82,34.54 53.34,33.02 53.34,30.89 51.61,29.16 51.61,26.62 47.55,22.55 46.74,22.55 45.41,21.23 44.6,21.23 TEENSY.47 | v46.63,49.48 46.63,53.03 45.72,53.95 45.72,54.76 44.91,55.58 44.09,55.58 v41.35,58.32 | v17.17,79.15 16.76,79.15 16.26,79.65 8.94,79.65 6.3,77.01 2.95,77.01 JOY1.5
  Bottom 0.254: v46.63,49.48 v51.82,44.3 | v41.35,58.32 41.35,59.13 39.83,60.66 38.91,60.66 33.93,65.63 33.93,68.07 28.96,73.05 23.27,73.05 v17.17,79.15
JOYBTN2  (via drill 0.38)
  Top 0.254: v78.64,42.77 78.64,42.37 58.83,22.55 54.36,22.55 48.87,17.07 43.89,17.07 42.57,18.39 42.57,20.93 44.09,22.45 44.91,22.45 45.72,23.27 45.72,24.08 47.04,25.4 47.04,26.21 TEENSY.44
  Bottom 0.254: v78.64,42.77 96.11,42.77 96.62,42.27 97.64,42.27 99.06,43.69 99.06,87.78 97.54,89.31 94.89,89.31 94.39,88.8 94.39,88.19 95.4,87.17 97.13,87.17 JOY2.5
JOYH1  (via drill 0.38)
  Top 0.406: v25.7,78.44 v38.41,78.44
  Bottom 0.406: v38.41,78.44 40.03,78.44 43.38,75.08 43.38,66.45 42.06,65.13 42.06,64.41 TEENSY.A11 | v25.7,78.44 25.4,78.44 22.05,81.79 7.62,81.79 7.42,81.99 2.95,81.99 JOY1.3
JOYH2  (via drill 0.38)
  Top 0.406: v58.01,30.28 61.57,33.83 61.67,33.83 62.18,34.34 v62.18,35.56 | v62.18,41.45 62.18,46.84 61.77,47.24 v61.77,49.78 | v87.38,65.84 v83.52,65.84
  Bottom 0.406: v58.01,30.28 58.01,18.59 55.78,16.36 54.97,16.36 53.44,17.88 53.44,19.2 54.66,20.42 54.66,21.13 TEENSY.31 | v62.18,41.45 v62.18,35.56 | v61.77,49.78 61.77,52.32 62.99,53.54 62.99,60.05 68.78,65.84 v83.52,65.84 | v87.38,65.84 92.76,65.84 93.07,66.14 93.17,66.14 94.89,67.87 94.89,79.76 97.13,81.99 JOY2.3
JOYV1  (via drill 0.38)
  Top 0.406: v35.97,83.82 43.38,76.4 43.38,68.99 42.06,67.67 42.06,66.95 TEENSY.A10 | v27.74,83.82 27.03,84.53 26.21,84.53 22.05,80.37 8.74,80.37 7.92,79.55 3.15,79.55 JOY1.4
  Bottom 0.406: v27.74,83.82 v35.97,83.82
JOYV2  (via drill 0.38)
  Top 0.406: v90.93,50.7 90.93,46.23 88.09,43.38 80.67,43.38 55.98,18.69 54.76,18.69 TEENSY.32 | v90.93,52.93 90.93,66.65 v93.78,69.49
  Bottom 0.406: v90.93,52.93 v90.93,50.7 | v93.78,69.49 93.78,81.38 96.93,84.53 JOY2.4
LED1  (via drill 0.38)
  Top 0.254: v40.95,24.38 40.95,18.39 29.87,7.32 20.02,7.32 18.69,5.99 STRIP1.7
  Bottom 0.254: v40.95,24.38 44.09,27.53 45.01,27.53 46.23,28.75 47.04,28.75 TEENSY.43
LED2  (via drill 0.38)
  Top 0.254: v40.64,52.93 37.08,52.93 35.76,51.61 29.77,51.61 29.67,51.71 v25.3,51.71 | v16.87,49.28 13.92,46.33 13.92,38.91 17.17,35.66 17.17,23.77 14.33,20.93 14.33,17.37 15.65,16.05 17.37,16.05 18.69,17.37 STRIP2.7
  Bottom 0.254: v40.64,52.93 48.36,45.21 48.36,38.61 47.14,37.39 47.14,36.47 TEENSY.41 | v25.3,51.71 23.37,51.71 20.83,49.17 16.97,49.17 v16.87,49.28
LED3  (via drill 0.38)
  Top 0.254: v44.6,42.27 45.21,42.27 45.72,42.77 49.17,42.77 54.36,47.95 56.29,47.95 63.5,55.17 70.92,55.17 75.29,59.54 77.32,59.54 77.52,59.33 79.25,59.33 80.57,58.01 STRIP3.7
  Bottom 0.254: v44.6,42.27 44.6,39.01 TEENSY.53
LED4  (via drill 0.38)
  Top 0.254: v73.05,79.05 79.25,79.05 79.96,78.33 81.38,78.33 83.92,80.87 87.58,80.87 v95.2,88.49 | v93.57,54.76 93.57,54.36 90.83,51.61 90.63,51.61 89.51,50.49 89.51,47.75 88.7,46.94 81.79,46.94 80.47,45.62 STRIP4.7
  Bottom 0.254: v73.05,79.05 66.55,79.05 62.08,74.57 54.76,74.57 TEENSY.0 | v95.2,88.49 97.74,88.49 98.65,87.58 98.65,59.84 v93.57,54.76
LED5
  Bottom 0.254: TEENSY.55 44.5,56.69 44.5,55.88 43.38,54.76 43.38,50.8 51,43.18 51,29.57 53.14,27.43 53.14,27.03 53.24,26.92 53.24,19.91 52.73,19.41 52.73,17.68 55.17,15.24 72.14,15.24 73.46,16.56 STRIP5.7
LED6  (via drill 0.38)
  Top 0.254: v45.72,50.19 45.72,46.53 v45.52,46.33
  Bottom 0.254: v45.72,50.19 45.72,59.84 44.6,60.96 44.6,61.77 TEENSY.57 | v45.52,46.33 45.52,39.73 45.82,39.42 45.82,30.89 46.63,30.07 47.55,30.07 48.26,29.36 48.26,23.27 47.45,22.45 46.63,22.45 45.82,21.64 45.82,18.19 59.74,4.27 72.14,4.27 73.46,5.59 STRIP6.7
M_INA
  Top 0.254: TEENSY.45 47.14,23.77 47.14,24.69 50.8,28.35 50.8,38.41 47.04,42.16 45.72,42.16 45.01,41.45 43.79,41.45 39.83,45.41 37.08,45.41 36.07,46.43 26.92,46.43 J4.2
M_INB  (via drill 0.38)
  Top 0.254: v47.85,35.15 43.08,35.15 40.95,37.29 v40.95,39.22 | v35.05,47.24 34.54,47.24 30.58,51.21 29.57,51.21 29.46,51.31 27.74,51.31 v27.33,50.9
  Bottom 0.254: v47.85,35.15 48.36,34.65 48.36,30.99 48.67,30.68 48.67,23.06 47.14,21.54 47.14,21.23 TEENSY.46 | v40.95,39.22 39.83,40.34 37.8,40.34 35.05,43.08 v35.05,47.24 | v27.33,50.9 27.33,49.48 24.38,46.53 J4.4
M_PWMA
  Top 0.254: TEENSY.36 39.42,26.31 37.59,26.31 31.09,32.82 31.09,36.07 26.92,40.23 26.92,43.59 J4.1
M_PWMB
  Top 0.254: TEENSY.35 39.42,23.77 38.81,23.77 30.68,31.9 30.68,35.87 24.38,42.16 24.38,43.59 J4.3
N$2
  Top 0.254: LED1.A 50.09,47.65 50.09,48.67 51.1,49.68 51.1,53.95 R1.2
N$3
  Bottom 0.254: R4.2 10.77,63.4 10.77,70.41 9.14,72.03 9.14,78.03 9.96,78.84 11.68,78.84 12.9,77.62 S1.A
N$4
  Top 0.254: R5.2 14.02,55.88 14.02,49.68 10.87,46.53 10.87,37.59 12.9,35.56 S2.A
N$5
  Top 0.254: R2.2 16.56,91.44 13.11,91.44 R3.1 13.11,91.54 J12.1
N$6
  Top 0.254: R6.2 80.57,71.83 81.69,71.83 84.84,74.98 85.65,74.98 86.97,76.3 86.97,77.52 S3.A
N$7
  Top 0.254: TEENSY.VIN 39.42,77.11 39.42,79.15 32.41,86.16 J1.1
N$8
  Top 0.254: R7.2 80.87,29.36 81.18,29.36 84.84,33.02 85.65,33.02 86.97,34.34 86.97,35.46 S4.A
PI-REST
  Top 0.254: R2.1 16.66,83.92 20.62,83.92 28.35,91.64 U1.6
PWM1
  Bottom 0.254: U2.8 60.15,62.48 59.64,62.48 55.88,66.24 55.88,68.28 54.76,69.39 TEENSY.2
PWM2
  Bottom 0.254: U2.7 60.15,61.27 59.74,61.27 54.76,66.24 54.76,66.85 TEENSY.3
PWM3
  Bottom 0.254: U2.6 60.15,59.94 59.13,59.94 54.76,64.31 TEENSY.4
PWM4
  Bottom 0.254: U2.5 60.15,58.73 57.81,58.73 54.76,61.77 TEENSY.5
PWM5
  Bottom 0.254: U2.4 60.15,57.4 56.59,57.4 54.76,59.23 TEENSY.6
PWM6
  Bottom 0.254: U2.3 60.15,56.19 55.27,56.19 54.76,56.69 TEENSY.7
PWM7
  Bottom 0.254: U2.2 60.15,54.76 55.27,54.76 54.76,54.25 TEENSY.8
PWM8
  Bottom 0.254: U2.1 60.15,53.54 56.59,53.54 54.76,51.71 TEENSY.9
PWM9  (via drill 0.38)
  Top 0.254: v35.87,52.83 v33.43,55.27 | v42.98,34.04 40.64,31.7 40.64,29.97 39.52,28.85 TEENSY.37
  Bottom 0.254: v33.43,55.27 29.87,55.27 U3.8 | v35.87,52.83 35.87,51.82 37.39,50.29 38.91,50.29 39.01,50.39 39.93,50.39 42.98,47.35 v42.98,34.04
PWM10  (via drill 0.38)
  Top 0.254: v33.53,56.59 37.9,56.59 39.01,55.47 41.35,55.47 v44.91,51.92
  Bottom 0.254: v33.53,56.59 29.87,56.59 U3.7 | v44.91,51.92 44.91,49.89 53.54,41.25 53.54,27.43 54.66,26.31 TEENSY.29
PWM11  (via drill 0.38)
  Top 0.254: v35.36,37.69 39.93,37.69 40.74,36.88 40.74,32.61 39.52,31.39 TEENSY.38
  Bottom 0.254: v35.36,37.69 33.73,39.32 33.73,40.34 33.12,40.95 33.12,52.83 34.34,54.05 34.34,56.9 33.43,57.81 29.87,57.81 U3.6
PWM12  (via drill 0.38)
  Top 0.254: v37.69,51.1 37.69,48.36 39.42,46.63 TEENSY.14
  Bottom 0.254: v37.69,51.1 37.69,54.76 33.02,59.44 32.41,59.44 32.21,59.23 29.87,59.23 U3.5
PWM13  (via drill 0.38)
  Top 0.254: v32.72,58.62 v31.29,60.05 | v38,41.25 39.01,40.23 41.66,40.23 44.2,37.69 47.55,37.69 48.67,36.58 48.67,33.83 47.45,32.61 46.63,32.61 45.82,31.8 v45.82,25.3 | v43.38,19.51 43.38,18.19 44.09,17.48 48.46,17.48 54.66,23.67 TEENSY.30
  Bottom 0.254: v31.29,60.05 30.99,60.35 29.87,60.35 U3.4 | v32.72,58.62 33.22,58.62 35.05,56.79 35.05,48.36 35.87,47.55 35.87,43.38 v38,41.25 | v45.82,25.3 45.82,23.37 44.91,22.45 44.09,22.45 43.38,21.74 v43.38,19.51
PWM14
  Bottom 0.254: U3.3 29.87,61.67 31.39,61.67 38.3,54.76 38.3,52.83 39.42,51.71 TEENSY.16
PWM15  (via drill 0.38)
  Top 0.254: v32.72,62.99 36.37,62.99 39.12,65.73 43.99,65.73 v47.24,68.99
  Bottom 0.254: v32.72,62.99 29.87,62.99 U3.2 | v47.24,68.99 49.28,71.02 50.7,71.02 53.54,68.17 53.54,50.29 54.66,49.17 TEENSY.10
PWM16
  Bottom 0.254: U3.1 29.87,64.21 32.61,64.21 37.49,59.33 37.49,56.19 39.42,54.25 TEENSY.17
PWM_1  (via drill 0.38)
  Top 0.61: v63.91,54.25 59.94,50.29 59.94,36.37 v58.32,34.75 | v64.82,24.89 64.82,21.95 50.49,7.62 31.9,7.62 27.94,3.66 23.47,3.66 21.23,5.89 STRIP1.5
  Bottom 0.61: v63.91,54.25 63.91,57.3 68.99,62.38 69.7,62.38 U2.13 | v58.32,34.75 58.32,31.39 v64.82,24.89
PWM_2  (via drill 0.38)
  Top 0.61: v71.12,60.55 69.8,60.55 v65.33,56.08 | v67.46,40.84 67.46,38.3 v56.19,27.03 | v55.37,17.27 50.19,17.27 49.07,16.15 v40.54,16.15 | v37.49,16.15 32.82,11.48 23.98,11.48 21.23,8.74 STRIP1.6
  Bottom 0.61: v71.12,60.55 70.51,61.16 69.8,61.16 U2.14 | v65.33,56.08 65.33,42.98 v67.46,40.84 | v56.19,27.03 56.19,18.09 v55.37,17.27 | v37.49,16.15 v40.54,16.15
PWM_3  (via drill 0.38)
  Top 0.61: v82.8,5.18 82.6,4.98 82.6,4.88 81.28,3.56 v40.74,3.56 | v30.58,13.72 24.99,13.72 21.34,17.37 STRIP2.5
  Bottom 0.61: v82.8,5.18 85.45,7.82 85.45,27.33 66.34,46.43 66.34,57.3 68.89,59.84 69.7,59.84 U2.15 | v30.58,13.72 v40.74,3.56
PWM_4  (via drill 0.38)
  Top 0.61: v84.23,5.18 81.08,2.03 16.76,2.03 v10.36,8.43 | v10.36,20.93 10.36,22.15 v14.12,25.91
  Bottom 0.61: v84.23,5.18 91.34,12.29 91.34,35.87 90.12,37.08 82.8,37.08 67.26,52.63 67.26,56.9 68.99,58.62 69.7,58.62 U2.16 | v10.36,20.93 v10.36,8.43 | v14.12,25.91 15.54,25.91 21.23,20.22 STRIP2.6
PWM_5
  Bottom 0.61: U2.17 69.8,57.3 72.34,57.3 77.01,52.63 77.83,52.63 83.11,57.91 STRIP3.5
PWM_6  (via drill 0.38)
  Top 0.61: v68.28,56.19 70.81,56.19 77.32,62.69 v77.52,62.69 | v81.18,62.69 83.11,60.76 STRIP3.6
  Bottom 0.61: v68.28,56.19 69.7,56.19 U2.18 | v81.18,62.69 v77.52,62.69
PWM_7
  Bottom 0.61: U2.19 69.7,54.76 68.99,54.76 68.38,54.15 68.38,52.83 77.32,43.89 81.28,43.89 82.91,45.52 STRIP4.5
PWM_8
  Bottom 0.61: U2.20 69.8,53.54 74.78,53.54 78.44,49.89 81.38,49.89 82.91,48.36 STRIP4.6
PWM_9  (via drill 0.38)
  Top 0.61: v12.09,54.15 9.96,54.15 v5.89,50.09 | v5.89,32 v5.89,39.73 | v99.06,21.54 99.06,23.47 97.54,24.99 91.75,24.99 81.79,15.04 77.62,15.04 76.1,16.56 STRIP5.5
  Bottom 0.61: v12.09,54.15 14.02,52.22 15.34,52.22 18.39,55.27 20.22,55.27 U3.13 | v5.89,39.73 v5.89,50.09 | v5.89,32 5.89,10.16 14.43,1.63 89.81,1.63 97.33,9.14 97.54,9.14 99.16,10.77 99.16,21.44 v99.06,21.54
PWM_10  (via drill 0.38)
  Top 0.61: v21.64,57.3 21.64,63.2 20.73,64.11 20.73,70.92 23.06,73.25 23.06,80.06 v26.62,83.62 | v92.76,67.06 92.76,57 94.59,55.17 94.59,47.75 77.11,30.28 v77.11,24.18
  Bottom 0.61: v21.64,57.3 21.03,56.69 20.32,56.69 U3.14 | v26.62,83.62 26.62,94.59 28.25,96.22 56.9,96.22 59.33,98.65 85.95,98.65 92.76,91.85 v92.76,67.06 | v77.11,24.18 76.1,23.16 76.1,19.41 STRIP5.6
PWM_11  (via drill 0.38)
  Top 0.61: v14.94,53.24 14.94,49.48 11.79,46.33 v11.79,39.93
  Bottom 0.61: v14.94,53.24 19.51,57.81 20.22,57.81 U3.15 | v11.79,39.93 9.65,37.8 9.55,37.8 8.23,36.47 8.23,9.14 14.83,2.54 72.95,2.54 76,5.59 STRIP6.5
PWM_12  (via drill 0.38)
  Top 0.61: v22.66,57.81 22.66,54.97 22.05,54.36 22.05,53.54 25.7,49.89 28.65,49.89 v29.16,50.39 | v31.09,44.4 28.96,42.27 28.96,39.42 v29.36,39.01 | v29.36,32.92 29.36,30.89 35.66,24.59 35.66,16.76 v35.56,16.66 | v43.18,14.83 43.99,14.02 v54.15,14.02
  Bottom 0.61: v22.66,57.81 21.34,59.13 20.32,59.13 U3.16 | v29.16,50.39 29.16,47.45 31.09,45.52 v31.09,44.4 | v29.36,32.92 v29.36,39.01 | v35.56,16.66 37.39,14.83 v43.18,14.83 | v54.15,14.02 55.17,13.01 77.52,13.01 78.13,12.39 78.13,10.46 76.1,8.43 STRIP6.6
PWM_13
  Bottom 0.61: U3.17 20.22,60.35 15.44,60.35 10.87,55.78 R4.1
PWM_14
  Bottom 0.61: U3.18 20.22,61.77 15.85,61.77 14.12,63.5 R5.1
PWM_15  (via drill 0.38)
  Top 0.61: v24.38,65.73 24.38,67.87 34.04,77.52 v36.07,77.52 | v48.67,81.18 59.13,81.18 68.07,90.12 68.07,92.76 68.68,93.37 72.14,93.37 80.47,85.04 80.47,79.45 R6.1
  Bottom 0.61: v24.38,65.73 21.64,62.99 20.32,62.99 U3.19 | v36.07,77.52 39.73,81.18 v48.67,81.18
PWM_16  (via drill 0.38)
  Top 0.61: v21.74,64.52 22.05,64.52 v34.04,52.53 | v34.65,39.62 34.65,38.71 32.51,36.58 v32.51,32.61 | v34.14,23.77 34.14,21.13 v32.82,19.81 | v47.04,13.01 54.56,13.01 63.8,22.25 63.8,25.3 75.39,36.88 80.77,36.88 R7.1
  Bottom 0.61: v21.74,64.52 21.54,64.31 20.32,64.31 U3.20 | v34.04,52.53 34.04,41.15 34.65,40.54 v34.65,39.62 | v32.51,32.61 32.51,27.74 34.14,26.11 v34.14,23.77 | v32.82,19.81 32.82,16.66 36.47,13.01 v47.04,13.01
RELAY-PWR
  Top 1.27: RELAY1.8 84.73,82.09 84.73,88.59 83.62,89.71 J3.PWR
S1  (via drill 0.38)
  Top 0.254: TEENSY.33 39.42,18.69 39.42,19.61 36.47,22.55 36.47,25.5 30.28,31.7 30.28,35.15 21.84,43.59 J4.5 21.74,43.59 20.42,42.27 16.15,42.27 15.14,43.28 v15.14,44.5 | v10.77,48.87 5.89,48.87 1.42,53.34 1.42,64.31 3.05,65.94 3.05,66.24 SERVO1.3
  Bottom 0.254: v15.14,44.5 v10.77,48.87
S2  (via drill 0.38)
  Top 0.254: v37.9,43.99 36.58,45.31 27.64,45.31 27.43,45.11 23.16,45.11 21.84,46.43 J4.6 | v8.03,53.75 3.15,58.62 SERVO2.3
  Bottom 0.254: v37.9,43.99 39.01,42.88 39.83,42.88 42.57,40.13 42.57,37.29 40.84,35.56 40.84,26.01 39.93,25.09 39.12,25.09 38.3,24.28 38.3,23.27 39.42,22.15 39.42,21.23 TEENSY.34 | v8.03,53.75 11.28,53.75 17.17,47.85 20.42,47.85 21.74,46.53 J4.6
TINY_LED  (via drill 0.38)
  Top 0.254: v52.53,70.41 52.32,70.21 52.32,69.19 51,67.87 51,61.77 R1.1 | v48.26,77.01 34.34,90.93 34.34,92.66 31.39,95.61 24.69,95.61 20.83,91.75 U1.3
  Bottom 0.254: v52.53,70.41 52.53,73.86 49.38,77.01 v48.26,77.01
TINY_RELAY  (via drill 0.38)
  Top 0.254: v63.5,84.12 65.53,82.09 66.95,82.09 RELAY1.1
  Bottom 0.254: v63.5,84.12 57.71,84.12 54.15,87.68 29.87,87.68 28.45,89.1 U1.7
TINY_SWITCH
  Top 0.254: U1.5 28.45,94.18 32.21,94.18 33.93,92.46 33.93,90.12 49.99,74.07 SW2.2

## Text on the board
tPlace: MO Teensy Breakout | 2017 Ali Momeni / Designed in Pittsburgh | v2-6
bPlace: MO Teensy Breakout | 2017 Ali Momeni / Designed in Pittsburgh | v2-5